# EAGLE schematic StreamDeck (EAGLE 9.6.2)
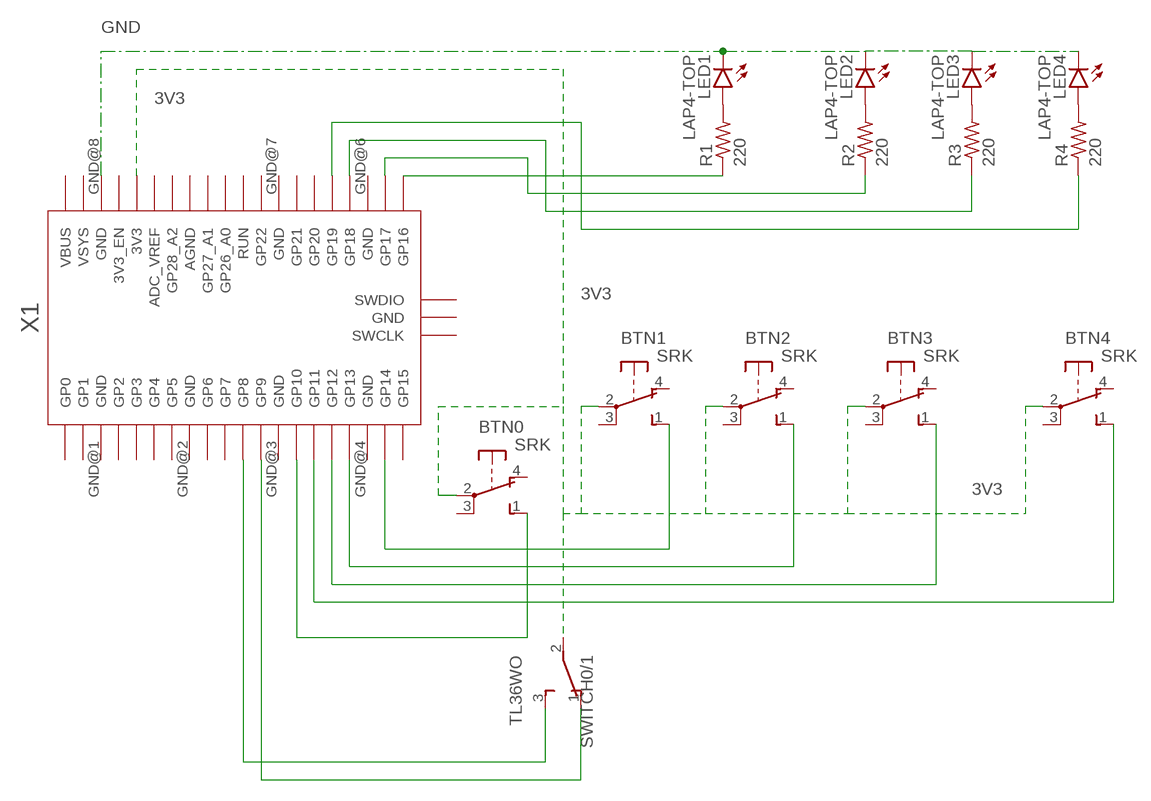
[diagram p0: schematic, sheet 1]

## Parts
BTN0  SRK  [SRK]
BTN1  SRK  [SRK]
BTN2  SRK  [SRK]
BTN3  SRK  [SRK]
BTN4  SRK  [SRK]
LED1  LAP4-TOP  [P47F-TOP]
LED2  LAP4-TOP  [P47F-TOP]
LED3  LAP4-TOP  [P47F-TOP]
LED4  LAP4-TOP  [P47F-TOP]
R1  220  R-US_0204/5  [0204/5]
R2  220  R-US_0204/5  [0204/5]
R3  220  R-US_0204/5  [0204/5]
R4  220  R-US_0204/5  [0204/5]
SWITCH0/1  TL36WO  [TL3XWO]
X1  RPI_PICO_IG-SMD  [RPI_PICO]

## Nets
3V3: BTN0.2(P) BTN1.2(P) BTN2.2(P) BTN3.2(P) BTN4.2(P) SWITCH0/1.2(P) X1.3V3
GND: LED1.C LED2.C LED3.C LED4.C X1.GND@8(GND)
N$2: LED1.A R1.2
N$3: LED2.A R2.2
N$4: LED3.A R3.2
N$5: LED4.A R4.2
N$6: BTN0.1(S) X1.GP10
N$7: R1.1 X1.GP16
N$8: R2.1 X1.GP17
N$9: R3.1 X1.GP18
N$10: R4.1 X1.GP19
N$11: BTN1.1(S) X1.GP14
N$12: BTN3.1(S) X1.GP12
N$13: BTN2.1(S) X1.GP13
N$14: BTN4.1(S) X1.GP11
N$15: SWITCH0/1.1(O) X1.GP9
N$16: SWITCH0/1.3(S) X1.GP8
Unconnected: BTN0.3(P) BTN0.4(O) BTN1.3(P) BTN1.4(O) BTN2.3(P) BTN2.4(O) BTN3.3(P) BTN3.4(O) BTN4.3(P) BTN4.4(O) X1.3V3_EN X1.ADC_VREF X1.AGND X1.GND@1(GND) X1.GND@2(GND) X1.GND@3(GND) X1.GND@4(GND) X1.GND@5(GND) X1.GND@6(GND) X1.GND@7(GND) X1.GP0 X1.GP1 X1.GP2 X1.GP3 X1.GP4 X1.GP5 X1.GP6 X1.GP7 X1.GP15 X1.GP20 X1.GP21 X1.GP22 X1.GP26_A0 X1.GP27_A1 X1.GP28_A2 X1.RUN X1.SWCLK X1.SWDIO X1.VBUS X1.VSYS

## Library data of the parts
BTN0 BTN1-BTN4 = switch-misc:SRK: SWITCH
LED1-LED4 = led:*P4: PointLED® Enhanced Thinfilm LED TOP & BOTTOM mount LS P47F, LR P47F, LA P47F, LY P47F, LT P4SG, LB P4SG, LW P4SG Source: http://catalog.osram-os.com .. LA_LR_LS_LY_P47F_Pb_free.pdf
R1-R4 = rcl:R-US_: RESISTOR, American symbol; SPICEPREFIX: R
SWITCH0/1 = switch:TL36WO: TINY SWITCH ON - ON Source: http://www2.produktinfo.conrad.com/datenblaetter/700000-724999/705152-da-01-de-Subminiaturschalter_TL_36WO.pdf
X1 = RaspberryPi_Pico:RPI_PICO_IG